# EAGLE design 8bitLineSensor (EAGLE 6.5.0)
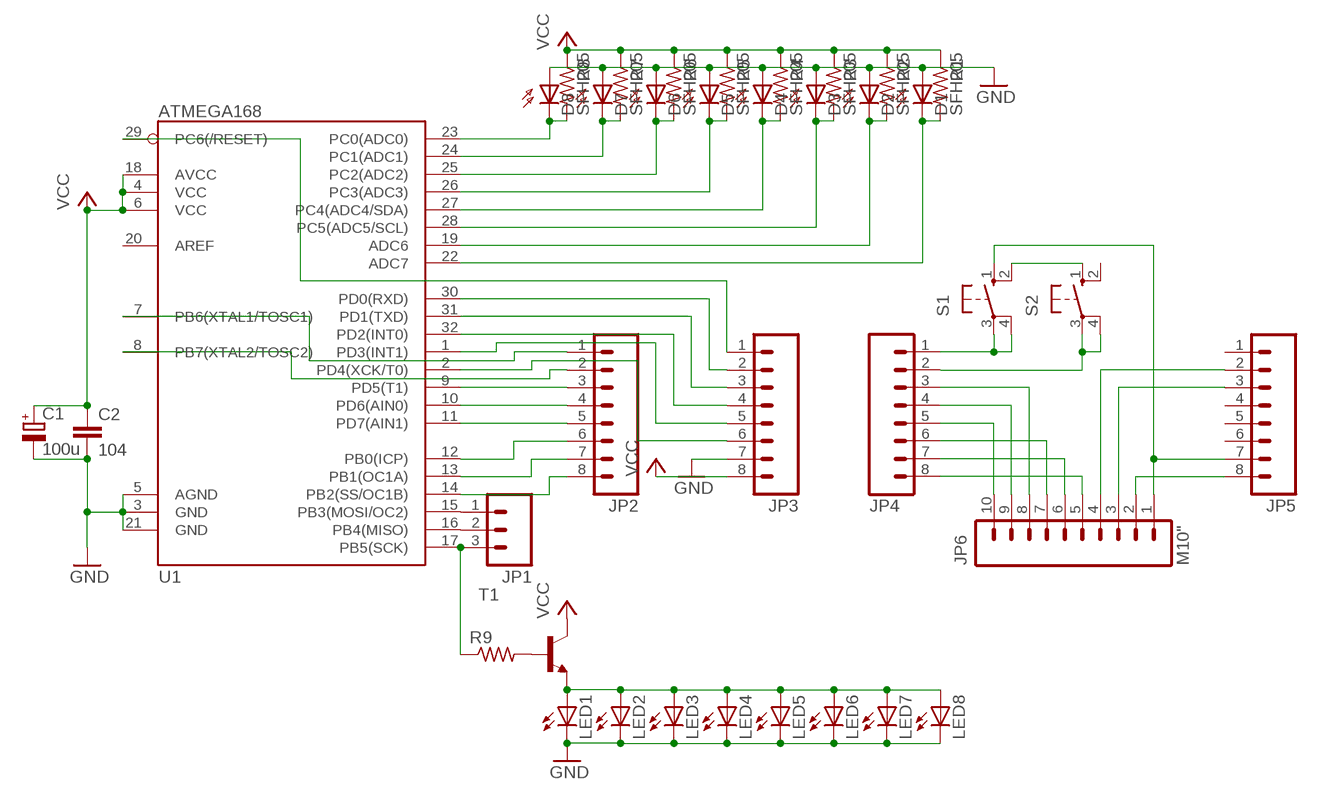
[diagram p0: schematic, sheet 1]

## Parts
C1  100u  CPOL-EUE2.5-7  [E2,5-7]
C2  104  C-EUC0805  [C0805]
D1  SFH205  [SFH205]
D2  SFH205  [SFH205]
D3  SFH205  [SFH205]
D4  SFH205  [SFH205]
D5  SFH205  [SFH205]
D6  SFH205  [SFH205]
D7  SFH205  [SFH205]
D8  SFH205  [SFH205]
JP1  M03PTH  [1X03]
JP2  M08  [1X08]
JP3  M08  [1X08]
JP4  M08  [1X08]
JP5  M08  [1X08]
JP6  M10"  [1X10]
LED1  LED5MM  [LED5MM]
LED2  LED5MM  [LED5MM]
LED3  LED5MM  [LED5MM]
LED4  LED5MM  [LED5MM]
LED5  LED5MM  [LED5MM]
LED6  LED5MM  [LED5MM]
LED7  LED5MM  [LED5MM]
LED8  LED5MM  [LED5MM]
R1  R-US_R0805  [R0805]
R2  R-US_R0805  [R0805]
R3  R-US_R0805  [R0805]
R4  R-US_R0805  [R0805]
R5  R-US_R0805  [R0805]
R6  R-US_R0805  [R0805]
R7  R-US_R0805  [R0805]
R8  R-US_R0805  [R0805]
R9  R-US_R0805  [R0805]
S1  10-XX  [B3F-10XX]
S2  10-XX  [B3F-10XX]
T1  MMBT2222ALT1-NPN-SOT23-BEC  [SOT23-BEC]
U1  ATMEGA168  [TQFP32-08]

## Nets
GND: C1.- C2.2 D1.A D2.A D3.A D4.A D5.A D6.A D7.A D8.A JP3.7 LED1.K(C) LED2.K(C) LED3.K(C) LED4.K(C) LED5.K(C) LED6.K(C) LED7.K(C) LED8.K(C) U1.3(GND) U1.5(AGND) U1.21(GND)
N$1: R9.2 T1.B
N$2: JP1.3 R9.1 U1.17(PB5(SCK))
N$3: JP2.6 U1.12(PB0(ICP))
N$4: D1.K(C) R1.2 U1.22(ADC7)
N$5: D2.K(C) R2.2 U1.19(ADC6)
N$6: JP2.7 U1.13(PB1(OC1A))
N$7: JP2.3 U1.9(PD5(T1))
N$9: JP2.4 U1.10(PD6(AIN0))
N$10: D3.K(C) R3.2 U1.28(PC5(ADC5/SCL))
N$11: JP2.5 U1.11(PD7(AIN1))
N$12: JP2.8 U1.14(PB2(SS/OC1B))
N$13: JP2.2 U1.8(PB7(XTAL2/TOSC2))
N$14: JP2.1 U1.7(PB6(XTAL1/TOSC1))
N$15: JP3.2 U1.30(PD0(RXD))
N$16: JP3.3 U1.31(PD1(TXD))
N$17: D4.K(C) R4.2 U1.27(PC4(ADC4/SDA))
N$18: D5.K(C) R5.2 U1.26(PC3(ADC3))
N$19: D6.K(C) R6.2 U1.25(PC2(ADC2))
N$20: D7.K(C) R7.2 U1.24(PC1(ADC1))
N$21: D8.K(C) R8.2 U1.23(PC0(ADC0))
N$22: JP3.4 U1.32(PD2(INT0))
N$23: JP3.5 U1.1(PD3(INT1))
N$24: JP3.6 U1.2(PD4(XCK/T0))
N$25: JP1.1 U1.15(PB3(MOSI/OC2))
N$26: JP1.2 U1.16(PB4(MISO))
N$27: LED1.A LED2.A LED3.A LED4.A LED5.A LED6.A LED7.A LED8.A T1.E
N$29: JP5.7 JP6.1 S1.1(S)
N$32: JP3.1 U1.29(PC6(/RESET))
N$35: JP5.8 JP6.2
N$36: JP4.6 JP6.7
N$38: JP4.7 JP6.6
N$46: JP4.3 JP6.8
N$47: JP4.4 JP6.9
N$48: JP4.5 JP6.10
N$49: JP4.8 JP6.5
N$50: JP5.2 JP6.4
N$51: JP5.3 JP6.3
N$52: JP4.1 S1.3(P) S1.4(P1)
N$53: JP4.2 S2.3(P) S2.4(P1)
N$54: S1.2(S1) S2.1(S)
VCC: C1.+ C2.1 JP3.8 R1.1 R2.1 R3.1 R4.1 R5.1 R6.1 R7.1 R8.1 T1.C U1.4(VCC) U1.6(VCC) U1.18(AVCC)
Unconnected: JP5.1 JP5.4 JP5.5 JP5.6 S2.2(S1) U1.20(AREF)

## Library data of the parts
C1 = rcl:CPOL-EU: POLARIZED CAPACITOR, European symbol
C2 = rcl:C-EU: CAPACITOR, European symbol
D1-D8 = opto-trans-siemens:SFH205: PHOTO DIODE; OC_FARNELL: unknown; OC_NEWARK: unknown
JP1 = SparkFun2010_04_13:M03: Header 3 Standard 3-pin 0.1" header. Use with straight break away headers (SKU : PRT-00116), right angle break away headers (PRT-00553), swiss pins (PRT-00743), machine pins (PRT-00117), and female headers (PRT-00115). Molex polarized connector foot print use with SKU : PRT-08232 with associated crimp pins and housings.
JP2-JP5 = SparkFun2010_04_13:M08: Header 8 Standard 8-pin 0.1" header. Use with straight break away headers (SKU : PRT-00116), right angle break away headers (PRT-00553), swiss pins (PRT-00743), machine pins (PRT-00117), and female headers (PRT-00115).
JP6 = SparkFun2010_04_13:M10: Header 10 Standard 10-pin 0.1" header. Use with straight break away headers (SKU : PRT-00116), right angle break away headers (PRT-00553), swiss pins (PRT-00743), machine pins (PRT-00117), and female headers (PRT-00115).
LED1-LED8 = SparkFun2010_04_13:LED: LEDs Standard schematic elements and footprints for 5mm, 3mm, 1206, and 0603 sized LEDs. 5mm - Spark Fun Electronics SKU : COM-00529 (and others)
R1-R9 = rcl:R-US_: RESISTOR, American symbol
S1 S2 = switch-omron:10-XX: OMRON SWITCH; MPN: B3F-1000; OC_FARNELL: 176432; OC_NEWARK: 36M3542
T1 = transistor:*-NPN-: NPN Transistror BF959 corrected 2008.03.06
U1 = SparkFun2010_04_13:ATMEGA168

## Net classes
1 power: width 0.61 mm

## Board
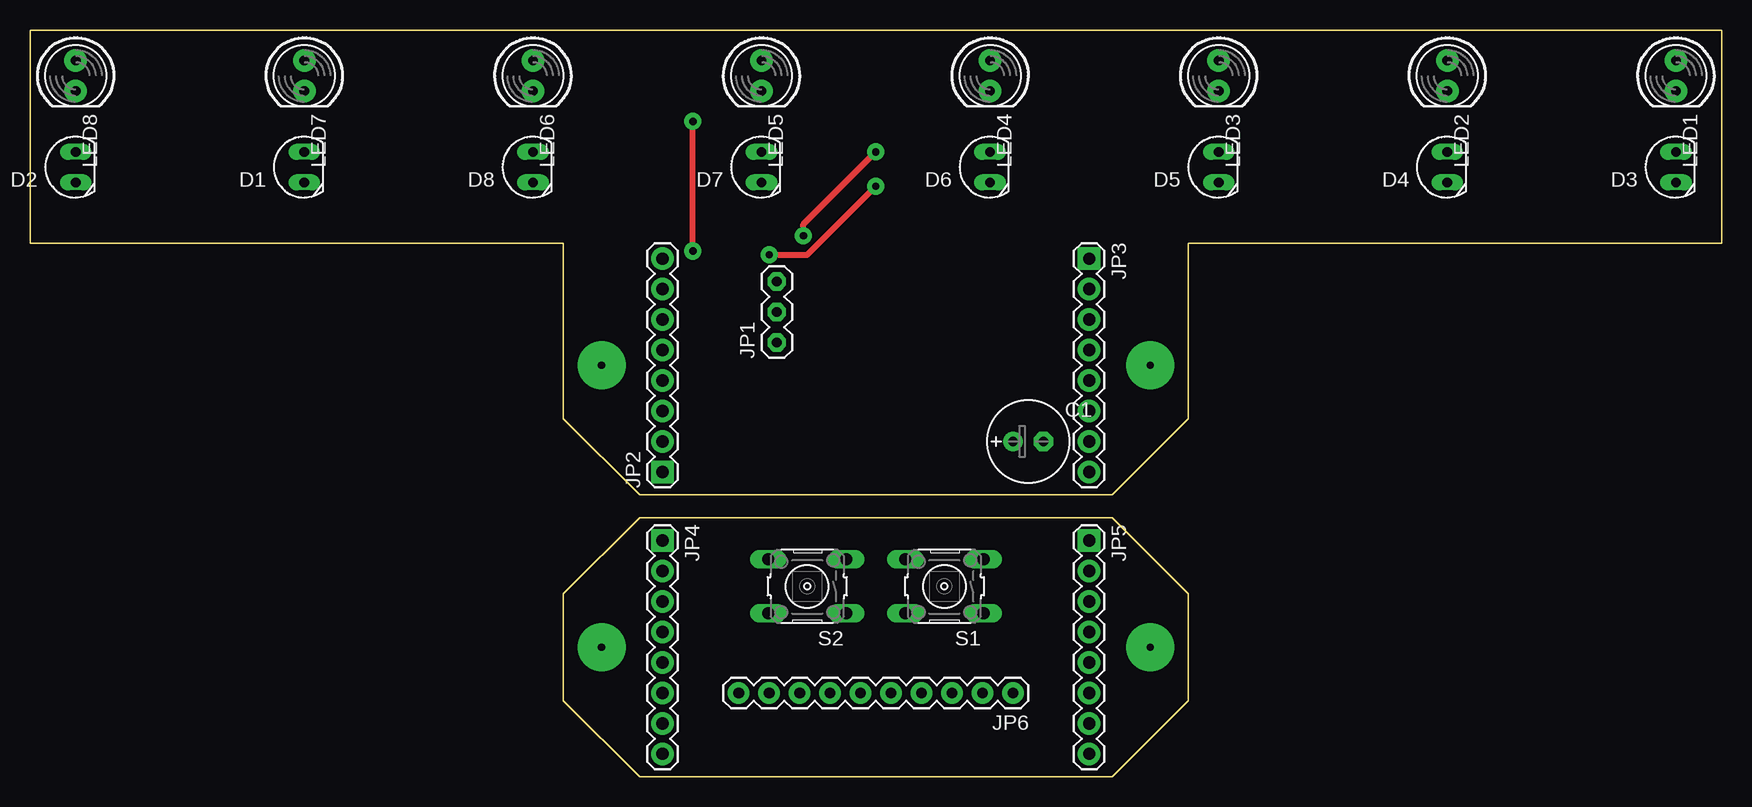
[diagram p1: board, top side]
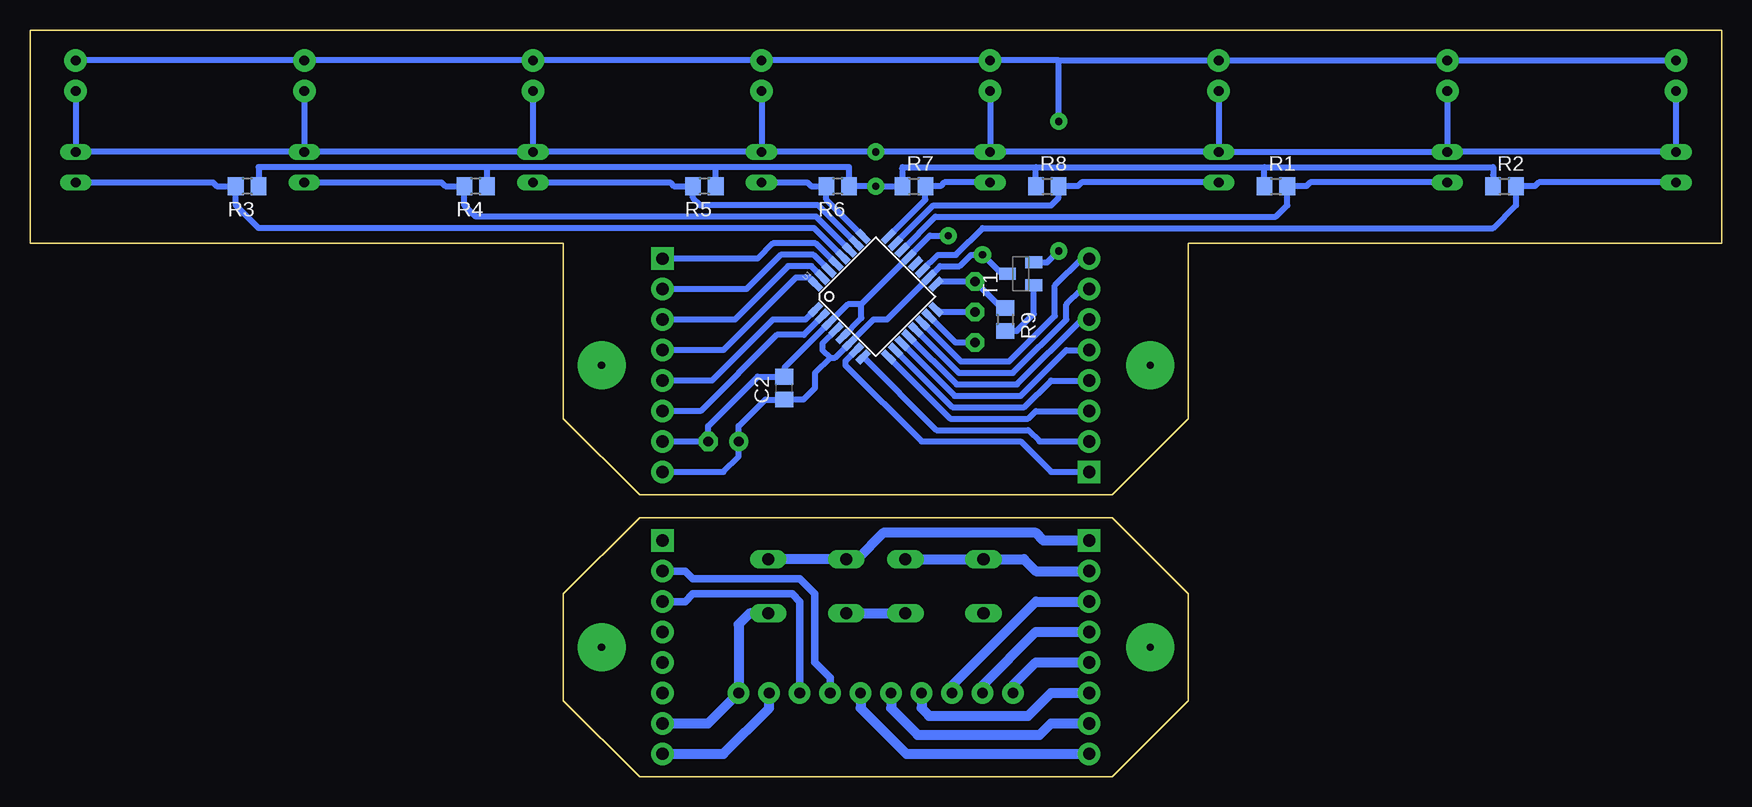
[diagram p2: board, bottom side, seen from below]

Size 140.97 x 62.23 mm. Coordinates in mm from the lower left corner, seen from the top.
Outline: 50.8,21.59 44.45,15.24 44.45,6.35 50.8,0 90.17,0 96.52,6.35 96.52,15.24 90.17,21.59 50.8,21.59
Outline: 50.8,23.5 44.45,29.84 44.45,44.45 0,44.45 0,62.23 140.97,62.23 140.97,44.45 96.52,44.45 96.52,29.84 90.17,23.5 50.8,23.5
Copper layers (1*16): Top 0.035mm / dielectric 1.5mm / Bottom 0.035mm
Design rules "default": minimum track width 10mil, minimum drill 24mil, track to track 8mil, track to pad 8mil, pad to pad 8mil, via to via 8mil, smd to smd 8mil, copper to edge 40mil, drill to drill 8mil, minimum pad ring 10mil, minimum via ring 8mil, stop-mask expansion 4mil, vias tented up to drill 0mil, thermal gap 10mil

### Footprints (pad centres in the part's own frame; a part is rotated, then mirrored left to right if it is on the bottom)
E2,5-7 = drill 0.813 pad 1.6: + -1.27,0 | drill 0.813 pad 1.6 octagon: - 1.27,0
C0805 = smd 1.3 x 1.5: 1 -0.95,0; 2 0.95,0
SFH205 = drill 0.813 long: A 0,-1.27; K 0,1.27
1X03 = drill 0.8 pad 1.524 octagon: 1 0,0; 2 2.54,0; 3 5.08,0
1X08 = drill 1.016 pad 1.88 square: 1 0,0 | drill 1.016 pad 1.88: 2 2.54,0; 3 5.08,0; 4 7.62,0; 5 10.16,0; 6 12.7,0; 7 15.24,0; 8 17.78,0
1X10 = drill 0.9 pad 1.778: 1 0,0; 2 2.54,0; 3 5.08,0; 4 7.62,0; 5 10.16,0; 6 12.7,0; 7 15.24,0; 8 17.78,0; 9 20.32,0; 10 22.86,0
LED5MM = drill 0.813 pad 1.88: A -1.27,0; K 1.27,0
R0805 = smd 1.3 x 1.5: 1 -0.95,0; 2 0.95,0
B3F-10XX = drill 1.016 long: 1 -3.251,2.261; 2 3.251,2.261; 3 -3.251,-2.261; 4 3.251,-2.261
SOT23-BEC = smd 1 x 1.4: B -0.95,-1.1; C 0,1.1; E 0.95,-1.1
TQFP32-08 = smd 1.27 x 0.559: 1 -4.293,2.8; 2 -4.293,2; 3 -4.293,1.2; 4 -4.293,0.4; 5 -4.293,-0.4; 6 -4.293,-1.2; 7 -4.293,-2; 8 -4.293,-2.8; 17 4.293,-2.8; 18 4.293,-2; 19 4.293,-1.2; 20 4.293,-0.4; 21 4.293,0.4; 22 4.293,1.2; 23 4.293,2; 24 4.293,2.8 | smd 0.559 x 1.27: 9 -2.8,-4.293; 10 -2,-4.293; 11 -1.2,-4.293; 12 -0.4,-4.293; 13 0.4,-4.293; 14 1.2,-4.293; 15 2,-4.293; 16 2.8,-4.293; 25 2.8,4.293; 26 2,4.293; 27 1.2,4.293; 28 0.4,4.293; 29 -0.4,4.293; 30 -1.2,4.293; 31 -2,4.293; 32 -2.8,4.293

### Placement (x,y rotation side)
C1  83.19,27.94 0 top
C2  78.11,32.39 90 bottom
D1  22.86,50.8 180 top
D2  3.81,50.8 180 top
D3  137.16,50.8 180 top
D4  118.11,50.8 180 top
D5  99.06,50.8 180 top
D6  80.01,50.8 180 top
D7  60.96,50.8 180 top
D8  41.91,50.8 180 top
JP1  62.23,36.2 90 top
JP2  52.7,25.4 90 top
JP3  88.27,43.18 270 top
JP4  52.7,19.69 270 top
JP5  88.27,19.69 270 top
JP6  81.91,6.98 180 top
LED1  137.16,58.42 270 top
LED2  118.11,58.42 270 top
LED3  99.06,58.42 270 top
LED4  80.01,58.42 270 top
LED5  60.96,58.42 270 top
LED6  41.91,58.42 270 top
LED7  22.86,58.42 270 top
LED8  3.81,58.42 270 top
R1  37.15,49.21 0 bottom
R2  18.1,49.21 0 bottom
R3  122.87,49.21 180 bottom
R4  103.82,49.21 180 bottom
R5  84.77,49.21 180 bottom
R6  73.66,49.21 180 bottom
R7  67.31,49.21 0 bottom
R8  56.2,49.21 0 bottom
R9  59.69,38.1 270 bottom
S1  76.2,15.88 180 top
S2  64.77,15.88 180 top
T1  58.42,41.91 90 bottom
U1  70.48,40.01 45 bottom

### Tracks (layer width: path | path; a pad name or v marks a point on that pad's centre or on a via)
GND  (via drill 0.6 pad 1.42)
  Top 0.508: v64.45,45.09 64.45,46.04 v70.48,52.07
  Bottom 0.508: D1.A D2.A LED8.K | D8.A D1.A | D8.A D7.A | D7.A v70.48,52.07 D6.A | D6.A D5.A | D5.A D4.A | D4.A D3.A LED1.K | 71.69,39.37 U1.21 65.97,45.09 v64.45,45.09 | 71.69,39.37 72.82,39.37 U1.3 78.11,34.08 C2.2 80.33,33.34 84.45,29.21 C1.- JP3.7 | U1.5 71.69,38.24 71.69,39.37 | LED2.K D4.A | LED3.K D5.A | LED4.K D6.A | LED5.K D7.A | LED6.K D8.A | LED7.K D1.A
N$1
  Bottom 0.508: R9.2 58.73,37.15 57.32,38.56 T1.B
N$2
  Bottom 0.508: U1.17 65.25,41.28 JP1.3 60,39.05 R9.1
N$3
  Bottom 0.508: U1.12 63.75,32.7 58.74,32.7 53.34,38.1 JP2.6
N$4
  Bottom 0.508: D1.K 34.29,49.53 34.61,49.21 R1.2 36.2,47.62 37.15,46.67 65.52,46.67 U1.22
N$5
  Bottom 0.508: D2.K 15.24,49.53 15.56,49.21 R2.2 17.15,47.62 19.05,45.72 61.59,45.72 63.82,43.5 65.3,43.5 U1.19
N$6
  Bottom 0.508: JP2.7 53.34,40.64 54.61,39.37 54.61,38.1 59.05,33.66 63.57,33.66 U1.13
N$7
  Bottom 0.508: U1.9 64.28,29.84 57.78,29.84 57.15,30.48 JP2.3
N$9
  Bottom 0.508: U1.10 64.11,30.8 58.1,30.8 55.88,33.02 JP2.4
N$10
  Bottom 0.508: D3.K 125.73,49.53 125.41,49.21 R3.2 123.82,47.62 121.92,45.72 75.63,45.72 U1.28
N$11
  Bottom 0.508: U1.11 63.93,31.75 58.42,31.75 54.61,35.56 JP2.5
N$12
  Bottom 0.508: JP2.8 53.34,43.18 55.56,40.96 55.56,38.42 59.37,34.61 63.39,34.61 U1.14
N$13
  Bottom 0.508: U1.8 65.44,28.89 57.78,28.89 56.83,27.94 JP2.2
N$14
  Bottom 0.508: U1.7 73.03,34.64 73.03,34.29 66.67,27.94 58.42,27.94 55.88,25.4 JP2.1
N$15
  Bottom 0.508: U1.30 75.67,43.5 78.42,43.5 81.28,40.64 JP3.2
N$16
  Bottom 0.508: U1.31 75.85,42.55 77.79,42.55 82.23,38.1 JP3.3
N$17
  Bottom 0.508: D4.K 106.68,49.53 106.36,49.21 R4.2 104.77,47.62 103.82,46.67 75.45,46.67 U1.27
N$18
  Bottom 0.508: D5.K 87.63,49.53 87.31,49.21 R5.2 85.72,48.26 85.09,47.62 75.28,47.62 U1.26
N$19
  Bottom 0.508: D6.K 76.2,49.53 75.88,49.21 R6.2 74.61,48.09 U1.25
N$20
  Bottom 0.508: D7.K 64.77,49.53 65.09,49.21 R7.2 66.36,48.09 U1.24
N$21
  Bottom 0.508: D8.K 53.34,49.53 53.66,49.21 R8.2 55.25,48.26 55.88,47.62 65.69,47.62 U1.23
N$22
  Bottom 0.508: JP3.4 83.19,35.56 77.15,41.59 76.03,41.59 U1.32
N$23
  Bottom 0.508: U1.1 76.35,38.1 79.06,38.1 84.14,33.02 JP3.5
N$24
  Bottom 0.508: U1.2 76.49,36.83 78.74,36.83 85.09,30.48 JP3.6
N$25
  Bottom 0.508: U1.15 63.85,36.2 JP1.1
N$26
  Bottom 0.508: U1.16 65.05,38.73 JP1.2
N$27  (via drill 0.6 pad 1.42)
  Top 0.508: v55.24,43.81 v55.24,54.61
  Bottom 0.508: v55.24,54.61 55.24,59.69 | 55.24,59.69 LED5.A LED4.A LED3.A LED2.A LED1.A | 55.24,59.69 LED6.A LED7.A LED8.A | T1.E 56.2,42.86 v55.24,43.81
N$29
  Bottom 0.813: JP5.7 84.45,4.45 JP6.1 81.91,12.7 81,13.61 S1.1
N$32
  Bottom 0.508: U1.29 75.5,44.45 79.06,44.45 80.33,43.18 JP3.1
N$35
  Bottom 0.813: JP5.8 83.19,1.91 79.38,5.71 JP6.2
N$36
  Bottom 0.813: JP6.7 66.67,5.71 66.04,5.08 57.78,5.08 55.88,6.98 JP4.6
N$38
  Bottom 0.813: JP6.6 69.22,5.71 66.99,3.49 56.83,3.49 55.88,4.45 JP4.7
N$46
  Bottom 0.813: JP6.8 64.14,7.62 57.15,14.61 JP4.3
N$47
  Bottom 0.813: JP6.9 61.59,7.62 57.15,12.07 JP4.4
N$48
  Bottom 0.813: JP6.10 59.05,7.62 57.15,9.53 JP4.5
N$49
  Bottom 0.813: JP6.5 71.75,5.71 67.94,1.91 JP4.8
N$50
  Bottom 0.61: JP5.2 86.36,17.15 85.72,16.51 76.83,16.51 75.56,15.24 75.56,9.53 74.3,8.26 JP6.4
N$51
  Bottom 0.61: JP5.3 86.36,14.61 85.72,15.24 77.47,15.24 76.83,14.61 JP6.3
N$52
  Bottom 0.813: JP4.1 56.52,19.69 57.15,20.32 69.85,20.32 72.03,18.14 S1.4 S1.3
N$53
  Bottom 0.813: S2.3 S2.4 58.14,18.14 57.15,17.15 JP4.2
N$54
  Bottom 0.813: S1.2 S2.1
N$55  (via drill 0.6 pad 4)
  other vias: 47.62,34.29
N$56  (via drill 0.6 pad 4)
  other vias: 93.34,34.29
N$57  (via drill 0.6 pad 4)
  other vias: 47.62,10.8
N$58  (via drill 0.6 pad 4)
  other vias: 93.34,10.8
VCC  (via drill 0.6 pad 1.42)
  Top 0.508: v61.59,43.5 64.77,43.5 v70.48,49.21
  Bottom 0.508: U1.4 74.93,36.13 74.93,35.56 74.3,34.92 | 74.3,34.92 73.87,34.92 U1.6 70.69,38.1 69.56,38.1 U1.18 65.12,42.55 63.5,42.55 62.55,43.5 v61.59,43.5 60.01,41.91 T1.C | 57.15,50.8 68.26,50.8 68.26,50.48 R7.1 v70.48,49.21 R6.1 72.71,50.8 83.82,50.8 | 57.15,50.8 38.1,50.8 | 38.1,50.8 19.05,50.8 19.05,50.16 R2.1 | R1.1 38.1,50.8 | R8.1 57.15,50.8 | 83.82,50.8 102.87,50.8 | 102.87,50.8 121.92,50.8 R3.1 | R4.1 102.87,50.8 | R5.1 83.82,50.8 | JP3.8 83.19,25.4 81.91,26.67 C1.+ 81.91,29.21 79.69,31.44 C2.1 76.52,31.44 75.56,32.39 75.56,33.66 74.3,34.92